# EAGLE design motorShield (EAGLE 7.4.0)
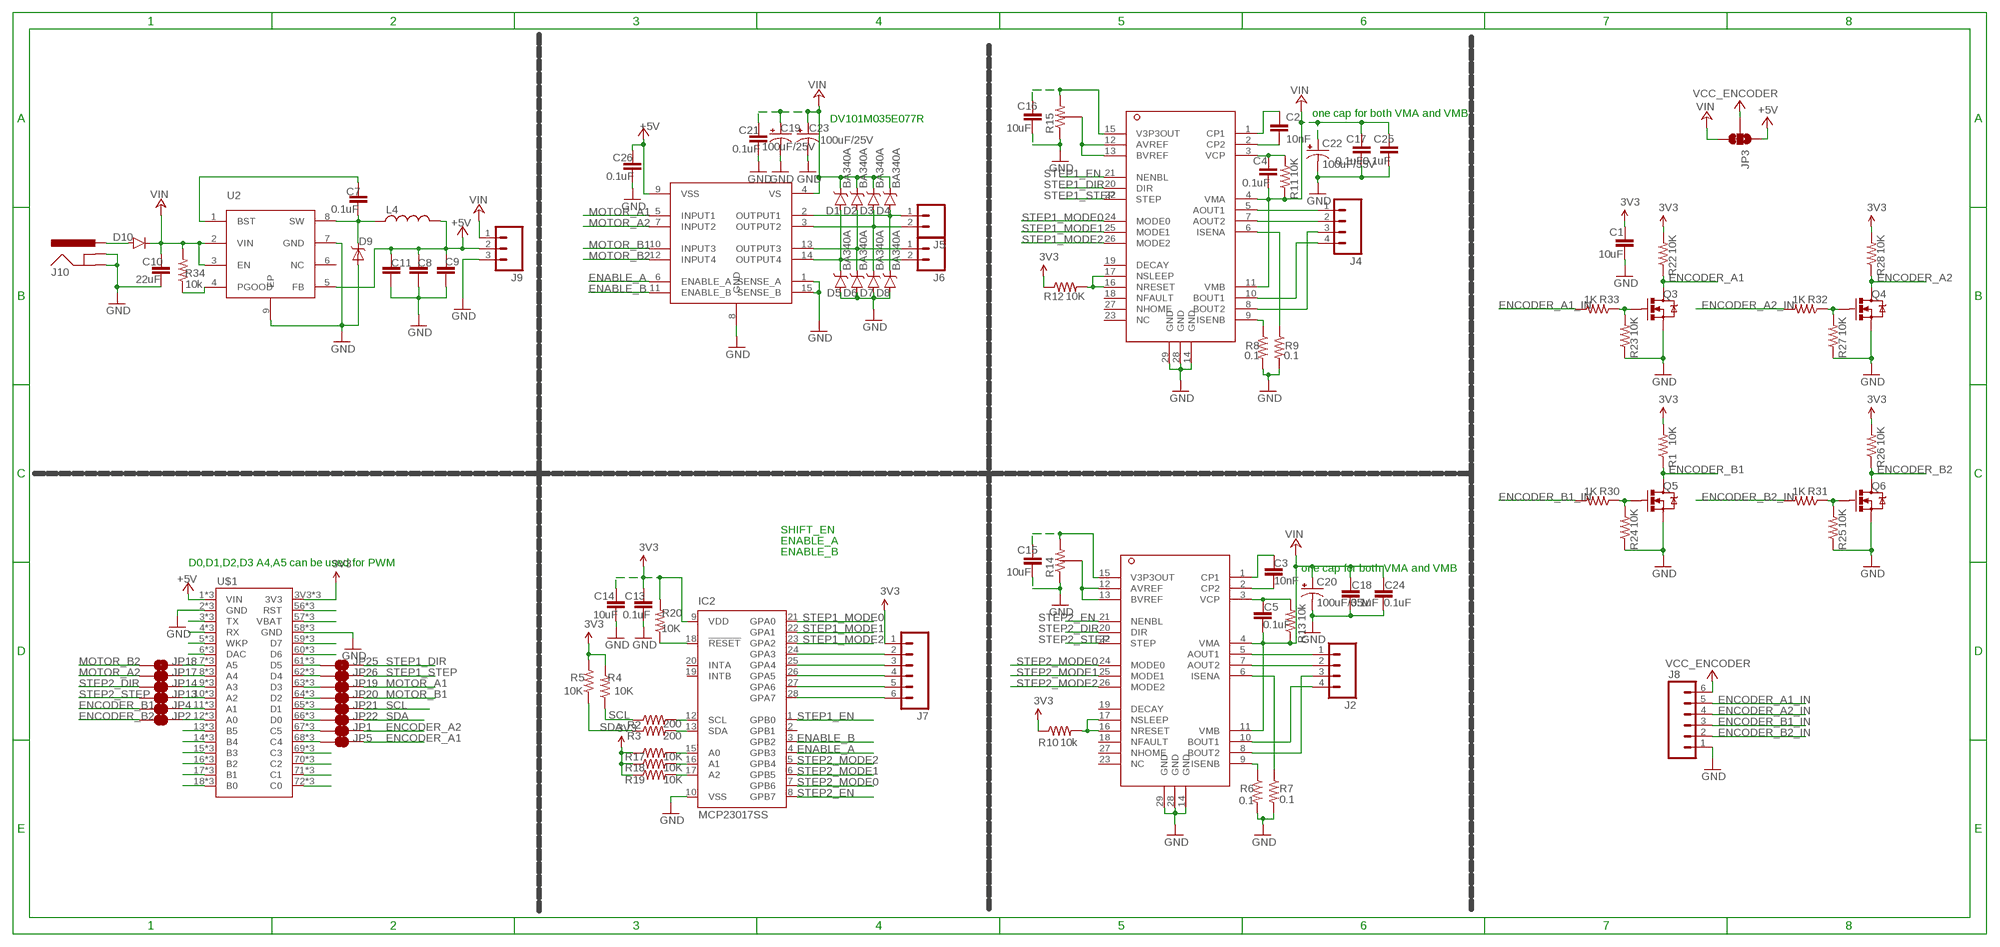
[diagram p0: schematic, sheet 1]

## Parts
C1  10uF  CAP_NONE_POL  [0603]
C2  10nF  CAP_NONE_POL  [0603]
C3  10nF  CAP_NONE_POL  [0603]
C4  0.1uF  CAP_NONE_POL  [0603]
C5  0.1uF  CAP_NONE_POL  [0603]
C7  0.1uF  0.1UF-100V-10%(0603)  [0603-CAP]
C8  10UF10V10%(0805)  [0805-CAP]
C9  10UF10V10%(0805)  [0805-CAP]
C10  22uF  22UF-16V-20%-(1210)  [1210]
C11  10UF10V10%(0805)  [0805-CAP]
C13  0.1uF  CAP_NONE_POL  [0603]
C14  10uF  CAP_NONE_POL  [0603]
C15  10uF  CAP_NONE_POL  [0603]
C16  10uF  CAP_NONE_POL  [0603]
C17  0.1uF  CAP_NONE_POL  [0603]
C18  0.1uF  CAP_NONE_POL  [0603]
C19  100uF/25V  CAP_POLD  [PANASONIC_D]
C20  100uF/35V  CAP_POLD  [PANASONIC_D]
C21  0.1uF  CAP_NONE_POL  [0603]
C22  100uF/35V  CAP_POLD  [PANASONIC_D]
C23  100uF/25V  CAP_POLD  [PANASONIC_D]
C24  0.1uF  CAP_NONE_POL  [0603]
C25  0.1uF  CAP_NONE_POL  [0603]
C26  0.1uF  CAP_NONE_POL  [0603]
D1  BA340A  B340A  [SMA-DIODE]
D2  BA340A  B340A  [SMA-DIODE]
D3  BA340A  B340A  [SMA-DIODE]
D4  BA340A  B340A  [SMA-DIODE]
D5  BA340A  B340A  [SMA-DIODE]
D6  BA340A  B340A  [SMA-DIODE]
D7  BA340A  B340A  [SMA-DIODE]
D8  BA340A  B340A  [SMA-DIODE]
D9  DIODE_SCHOTTKYA  [DIODE_SMA]
D10  DIODEB  [DIODE-DO-220AA_NT(SMP)]
IC2  MCP23017SS  [SSOP28]
J2  M04SCREW  [SCREWTERMINAL-3.5MM-4]
J4  M04SCREW  [SCREWTERMINAL-3.5MM-4]
J5  M023.5MM_LOCK  [SCREWTERMINAL-3.5MM-2_LOCK]
J6  M023.5MM_LOCK  [SCREWTERMINAL-3.5MM-2_LOCK]
J7  M06POLAR  [MOLEX-1X6]
J8  M06POLAR  [MOLEX-1X6]
J9  M03SCREW  [SCREWTERMINAL-3.5MM-3]
J10  POWER_JACKPTH  [POWER_JACK_PTH]
JP1  JUMPER-PAD-2-NC_BY_TRACENO_SILK  [PAD-JUMPER-2-NC_BY_TRACE_NO_SILK]
JP2  JUMPER-PAD-2-NC_BY_TRACENO_SILK  [PAD-JUMPER-2-NC_BY_TRACE_NO_SILK]
JP3  JUMPER-PAD-3-2OF3_NC_BY_TRACE_LARGE  [PAD-JUMPER-3-2OF3_NC_BY_TRACE_YES_SILK_LARGE]
JP4  JUMPER-PAD-2-NC_BY_TRACENO_SILK  [PAD-JUMPER-2-NC_BY_TRACE_NO_SILK]
JP5  JUMPER-PAD-2-NC_BY_TRACENO_SILK  [PAD-JUMPER-2-NC_BY_TRACE_NO_SILK]
JP13  JUMPER-PAD-2-NC_BY_TRACENO_SILK  [PAD-JUMPER-2-NC_BY_TRACE_NO_SILK]
JP14  JUMPER-PAD-2-NC_BY_TRACENO_SILK  [PAD-JUMPER-2-NC_BY_TRACE_NO_SILK]
JP17  JUMPER-PAD-2-NC_BY_TRACENO_SILK  [PAD-JUMPER-2-NC_BY_TRACE_NO_SILK]
JP18  JUMPER-PAD-2-NC_BY_TRACENO_SILK  [PAD-JUMPER-2-NC_BY_TRACE_NO_SILK]
JP19  JUMPER-PAD-2-NC_BY_TRACENO_SILK  [PAD-JUMPER-2-NC_BY_TRACE_NO_SILK]
JP20  JUMPER-PAD-2-NC_BY_TRACENO_SILK  [PAD-JUMPER-2-NC_BY_TRACE_NO_SILK]
JP21  JUMPER-PAD-2-NC_BY_TRACENO_SILK  [PAD-JUMPER-2-NC_BY_TRACE_NO_SILK]
JP22  JUMPER-PAD-2-NC_BY_TRACENO_SILK  [PAD-JUMPER-2-NC_BY_TRACE_NO_SILK]
JP25  JUMPER-PAD-2-NC_BY_TRACENO_SILK  [PAD-JUMPER-2-NC_BY_TRACE_NO_SILK]
JP26  JUMPER-PAD-2-NC_BY_TRACENO_SILK  [PAD-JUMPER-2-NC_BY_TRACE_NO_SILK]
L4  INDUCTOR4818  [I4818]
Q3  MOSFET-NCHANNELBSS138  [SOT23]
Q4  MOSFET-NCHANNELBSS138  [SOT23]
Q5  MOSFET-NCHANNELBSS138  [SOT23]
Q6  MOSFET-NCHANNELBSS138  [SOT23]
R1  10K  R-US_A  [R0603]
R2  200  R-US_A  [R0603]
R3  200  R-US_A  [R0603]
R4  10K  R-US_A  [R0603]
R5  10K  R-US_A  [R0603]
R6  0.1  R-US_M1206  [M1206]
R7  0.1  R-US_M1206  [M1206]
R8  0.1  R-US_M1206  [M1206]
R9  0.1  R-US_M1206  [M1206]
R10  10k  R-US_A  [R0603]
R11  10K  R-US_A  [R0603]
R12  10K  R-US_A  [R0603]
R13  10k  R-US_A  [R0603]
R14  POTENTIAL_RESISTOR  [POTENTIAL_RESISTOR_2]
R15  POTENTIAL_RESISTOR  [POTENTIAL_RESISTOR_2]
R17  10K  R-US_A  [R0603]
R18  10K  R-US_A  [R0603]
R19  10K  R-US_A  [R0603]
R20  10K  R-US_A  [R0603]
R22  10K  R-US_A  [R0603]
R23  10K  R-US_A  [R0603]
R24  10K  R-US_A  [R0603]
R25  10K  R-US_A  [R0603]
R26  10K  R-US_A  [R0603]
R27  10K  R-US_A  [R0603]
R28  10K  R-US_A  [R0603]
R30  1K  R-US_A  [R0603]
R31  1K  R-US_A  [R0603]
R32  1K  R-US_A  [R0603]
R33  1K  R-US_A  [R0603]
R34  10k  20OHM1/10W1%(0603)SMD  [0603-RES]
U2  ADP2303  [ADP2302]
U$1  ELECTRONDUALROW  [ELECTRON_DUAL-ROW]
U?1  DRV8825  [DRV8825]
U?2  L298  [L298]
U?3  DRV8825  [DRV8825]

## Nets
+5V: C8.2 C9.2 C11.1 C26.1(ANODE) J8.6 J9.2 JP3.1 JP3.2 L4.2 U2.5(FB) U$1.1(VIN) U$1.37(VIN) U$1.VIN U?2.9(VSS) ; supply symbol labelled VCC_ENCODER
+24V: C4.2(CATHODE) C5.2(CATHODE) C10.1 C17.1(ANODE) C18.1(ANODE) C19.+ C20.+ C21.1(ANODE) C22.+ C23.+ C24.1(ANODE) C25.1(ANODE) D1.C D2.C D3.C D4.C D10.CATHODE J9.1 JP3.3 R11.1 R13.1 R34.2 U2.2(VIN) U2.3(EN) U?1.4(VMA) U?1.11(VMB) U?2.4(VS) U?3.4(VMA) U?3.11(VMB) ; supply symbol labelled VIN
ENABLE_A: IC2.4(GPB3) U?2.6(ENABLE_A)
ENABLE_B: IC2.3(GPB2) U?2.11(ENABLE_B)
ENCODER_A1: JP5.2 Q3.3(D) R22.1
ENCODER_A1_IN: J8.5 R33.2
ENCODER_A2: JP1.2 Q4.3(D) R28.1
ENCODER_A2_IN: J8.4 R32.2
ENCODER_B1: JP4.1 Q5.3(D) R1.1
ENCODER_B1_IN: J8.3 R30.2
ENCODER_B2: JP2.1 Q6.3(D) R26.1
ENCODER_B2_IN: J8.2 R31.2
GND: C1.2(CATHODE) C8.1 C9.1 C10.2 C11.2 C13.2(CATHODE) C14.2(CATHODE) C15.2(CATHODE) C16.2(CATHODE) C17.2(CATHODE) C18.2(CATHODE) C19.- C20.- C21.2(CATHODE) C22.- C23.- C24.2(CATHODE) C25.2(CATHODE) C26.2(CATHODE) D5.A D6.A D7.A D8.A D9.ANODE IC2.10(VSS) J8.1 J9.3 J10.GND J10.GNDBREAK Q3.2(S) Q4.2(S) Q5.2(S) Q6.2(S) R6.2 R7.2 R8.2 R9.2 R14.1 R15.1 R23.1 R24.1 R25.1 R27.1 U2.7(GND) U2.9(EP) U$1.2(GND) U$1.38(GND) U$1.58(GND) U$1.94(GND) U$1.GND U$1.GND@2(GND) U?1.14(GND) U?1.28(GND) U?1.29(GND) U?2.1(SENSE_A) U?2.8(GND) U?2.15(SENSE_B) U?3.14(GND) U?3.28(GND) U?3.29(GND)
MOTOR_A1: JP19.2 U?2.5(INPUT1)
MOTOR_A2: JP17.1 U?2.7(INPUT2)
MOTOR_B1: JP20.2 U?2.10(INPUT3)
MOTOR_B2: JP18.1 U?2.12(INPUT4)
N$1: IC2.13(SDA) R3.2
N$2: IC2.12(SCL) R2.2
N$3: C3.2(CATHODE) U?3.2(CP2)
N$4: C3.1(ANODE) U?3.1(CP1)
N$5: C2.2(CATHODE) U?1.2(CP2)
N$6: C2.1(ANODE) U?1.1(CP1)
N$7: R6.1 U?3.9(ISENB)
N$8: R7.1 U?3.6(ISENA)
N$9: R10.2 U?3.16(NRESET) U?3.17(NSLEEP)
N$10: D4.A D8.C J5.1 U?2.2(OUTPUT1)
N$11: J2.1 U?3.5(AOUT1)
N$12: J2.2 U?3.7(AOUT2)
N$13: J2.4 U?3.10(BOUT1)
N$14: J2.3 U?3.8(BOUT2)
N$15: R8.1 U?1.9(ISENB)
N$16: R9.1 U?1.6(ISENA)
N$17: J4.1 U?1.5(AOUT1)
N$18: J4.2 U?1.7(AOUT2)
N$19: J4.4 U?1.10(BOUT1)
N$20: J4.3 U?1.8(BOUT2)
N$21: C4.1(ANODE) R11.2 U?1.3(VCP)
N$22: C5.1(ANODE) R13.2 U?3.3(VCP)
N$23: D3.A D7.C J5.2 U?2.3(OUTPUT2)
N$24: D2.A D6.C J6.1 U?2.13(OUTPUT3)
N$25: D1.A D5.C J6.2 U?2.14(OUTPUT4)
N$26: JP26.1 U$1.62(D4) U$1.98(D4) U$1.D4
N$27: IC2.15(A0) R17.2
N$28: R12.2 U?1.16(NRESET) U?1.17(NSLEEP)
N$29: IC2.16(A1) R18.2
N$30: IC2.17(A2) R19.2
N$31: R15.3 U?1.12(AVREF) U?1.13(BVREF)
N$32: IC2.18(!RESET) R20.1
N$33: IC2.28(GPA7) J7.6
N$34: R14.3 U?3.12(AVREF) U?3.13(BVREF)
N$35: IC2.27(GPA6) J7.5
N$36: IC2.26(GPA5) J7.4
N$37: IC2.25(GPA4) J7.3
N$38: IC2.24(GPA3) J7.2
N$39: JP25.1 U$1.61(D5) U$1.97(D5) U$1.D5
N$40: JP1.1 U$1.67(C5) U$1.103(C5) U$1.C5
N$41: JP2.2 U$1.12(A0) U$1.48(A0) U$1.A0
N$42: JP4.2 U$1.11(A1) U$1.47(A1) U$1.A1
N$44: JP5.1 U$1.68(C4) U$1.104(C4) U$1.C4
N$46: U$1.72(C0) U$1.108(C0) U$1.C0
N$47: U$1.71(C1) U$1.107(C1) U$1.C1
N$48: U$1.70(C2) U$1.106(C2) U$1.C2
N$49: U$1.69(C3) U$1.105(C3) U$1.C3
N$50: U$1.60(D6) U$1.96(D6) U$1.D6
N$51: Q4.1(G) R27.2 R32.1
N$52: Q5.1(G) R24.2 R30.1
N$53: Q6.1(G) R25.2 R31.1
N$54: C7.2 D9.CATHODE L4.1 U2.8(SW)
N$55: Q3.1(G) R23.2 R33.1
N$56: C7.1 U2.1(BST)
N$57: R34.1 U2.4(PGOOD)
N$58: D10.ANODE J10.PWR
N$59: U$1.59(D7) U$1.95(D7) U$1.D7
N$61: JP13.2 U$1.10(A2) U$1.46(A2) U$1.A2
N$62: JP14.2 U$1.9(A3) U$1.45(A3) U$1.A3
N$63: JP17.2 U$1.8(A4) U$1.44(A4) U$1.A4
N$64: JP18.2 U$1.7(A5) U$1.43(A5) U$1.A5
N$65: JP19.1 U$1.63(D3) U$1.99(D3) U$1.D3
N$66: JP20.1 U$1.64(D2) U$1.100(D2) U$1.D2
N$67: JP21.1 U$1.65(D1) U$1.101(D1) U$1.D1
N$68: JP22.1 U$1.66(D0) U$1.102(D0) U$1.D0
N$69: U$1.57(VBAT) U$1.93(VBAT) U$1.VBAT
N$70: U$1.56(RST) U$1.92(RST) U$1.RST
N$71: U$1.3(TX) U$1.39(TX) U$1.TX
N$72: U$1.4(RX) U$1.40(RX) U$1.RX
N$73: C15.1(ANODE) R14.2 U?3.15(V3P3OUT)
N$74: U$1.5(WKP) U$1.41(WKP) U$1.WKP
N$75: U$1.6(DAC) U$1.42(DAC) U$1.DAC
N$76: U$1.13(B5) U$1.49(B5) U$1.B5
N$77: U$1.14(B4) U$1.50(B4) U$1.B4
N$78: C16.1(ANODE) R15.2 U?1.15(V3P3OUT)
N$79: U$1.15(B3) U$1.51(B3) U$1.B3
N$80: U$1.16(B2) U$1.52(B2) U$1.B2
N$81: U$1.17(B1) U$1.53(B1) U$1.B1
N$82: U$1.18(B0) U$1.54(B0) U$1.B0
SCL: JP21.2 R2.1 R4.1
SDA: JP22.2 R3.1 R5.1
STEP1_DIR: JP25.2 U?1.20(DIR)
STEP1_EN: IC2.1(GPB0) U?1.21(NENBL)
STEP1_MODE0: IC2.21(GPA0) U?1.24(MODE0)
STEP1_MODE1: IC2.22(GPA1) U?1.25(MODE1)
STEP1_MODE2: IC2.23(GPA2) U?1.26(MODE2)
STEP1_STEP: JP26.2 U?1.22(STEP)
STEP2_DIR: JP14.1 U?3.20(DIR)
STEP2_EN: IC2.8(GPB7) U?3.21(NENBL)
STEP2_MODE0: IC2.7(GPB6) U?3.24(MODE0)
STEP2_MODE1: IC2.6(GPB5) U?3.25(MODE1)
STEP2_MODE2: IC2.5(GPB4) U?3.26(MODE2)
STEP2_STEP: JP13.1 U?3.22(STEP)
VDD: C1.1(ANODE) C13.1(ANODE) C14.1(ANODE) IC2.9(VDD) J7.1 R1.2 R4.2 R5.2 R10.1 R12.1 R17.1 R18.1 R19.1 R20.2 R22.2 R26.2 R28.2 U$1.3V3 U$1.55(3V3) U$1.91(3V3) ; supply symbol labelled 3V3
Unconnected: IC2.2(GPB1) IC2.19(INTB) IC2.20(INTA) U2.6(NC) U?1.18(NFAULT) U?1.19(DECAY) U?1.23(NC) U?1.27(NHOME) U?3.18(NFAULT) U?3.19(DECAY) U?3.23(NC) U?3.27(NHOME)

## Notes on the sheet
- one cap for both VMA and VMB
- DV101M035E077R
- SHIFT_EN
- ENABLE_A
- ENABLE_B
- D0,D1,D2,D3 A4,A5 can be used for PWM
- one cap for both VMA and VMB

## Library data of the parts
C1-C5 C13-C18 C21 C24-C26 = Particle:CAP_NONE_POL
C7 = SparkFun-Capacitors:0.1UF-100V-10%(0603): CAP-08390; PROD_ID: CAP-08390
C8 C9 C11 = programming-rig-v402:10UF10V10%(0805): CAP-11330; PROD_ID: CAP-11330
C10 = programming-rig-v402:22UF-16V-20%-(1210): CAP-10381; PROD_ID: CAP-10381
C19 C20 C22 C23 = SparkFun-Capacitors:CAP_POL: Capacitor Polarized These are standard SMD and PTH capacitors. Normally 10uF, 47uF, and 100uF in electrolytic and tantalum varieties. Always verify the external diameter of the through hole cap, it varies with capacity, voltage, and manufacturer. The EIA devices should be standard.
D1-D8 = SparkFun-DiscreteSemi:B340A: Schottky Diode 3A-40V; PROD_ID: DIO-09886
D9 = Particle:DIODE_SCHOTTKY
D10 = Particle:DIODE
IC2 = programming-rig-v402:MCP23017: http://ww1.microchip.com/downloads/en/DeviceDoc/21952a.pdf Source: http://ww1.microchip.com/downloads/en/DeviceDoc/21952a.pdf
J2 J4 = SparkFun-Connectors:M04: Header 4 Standard 4-pin 0.1" header. Use with straight break away headers (SKU : PRT-00116), right angle break away headers (PRT-00553), swiss pins (PRT-00743), machine pins (PRT-00117), and female headers (PRT-00115). Molex polarized connector foot print use with SKU : PRT-08231 with associated crimp pins and housings. 1MM SMD Version SKU: PRT-10208; PROD_ID: Combine 2x8399
J5 J6 = SparkFun-Connectors:M02: Standard 2-pin 0.1" header. Use with - straight break away headers ( PRT-00116) - right angle break away headers (PRT-00553) - swiss pins (PRT-00743) - machine pins (PRT-00117) - female headers (PRT-00115) Molex polarized connector foot print use with: PRT-08233 with associated crimp pins and housings. 2.54_SCREWTERM for use with PRT-10571. 3.5mm Screw Terminal footprints for PRT-08084 5mm Screw Terminal footprints for use with PRT-08432; PROD_ID: CONN-08399
J7 J8 = SparkFun-Connectors:M06: Header 6 Standard 6-pin 0.1" header. Use with straight break away headers (SKU : PRT-00116), right angle break away headers (PRT-00553), swiss pins (PRT-00743), machine pins (PRT-00117), and female headers (PRT-00115). Molex polarized connector foot print use with SKU : PRT-08094 with associated crimp pins and housings. NOTES ON THE VARIANTS LOCK and LOCK_LONGPADS... This footprint was designed to help hold the alignment of a through-hole component (i.e. 6-pin header) while soldering it into place. You may notice that each hole has been shifted either up or down by 0.005 of an inch from it's more standard position (which is a perfectly straight line). This slight alteration caused the pins (the squares in the middle) to touch the edges of the holes. Because they are alternating, it causes a "brace" to hold the component in place. 0.005 has proven to be the perfect amount of "off-center" position when using our standard breakaway headers. Although looks a little odd when you look at the bare footprint, once you have a header in there, the alteration is very hard to notice. Also,if you push a header all the way into place, it is covered up entirely on the bottom side. This idea of altering the position of holes to aid alignment will be further integrated into the Sparkfun Library for other footprints. It can help hold any component with 3 or more connection pins.
J9 = SparkFun-Connectors:M03: Header 3 Standard 3-pin 0.1" header. Use with straight break away headers (SKU : PRT-00116), right angle break away headers (PRT-00553), swiss pins (PRT-00743), machine pins (PRT-00117), and female headers (PRT-00115). Molex polarized connector foot print use with SKU : PRT-08232 with associated crimp pins and housings.; PROD_ID: CONN-08288
J10 = SparkFun-Connectors:POWER_JACK: Power Jack This is the standard 5.5mm barrel jack for power. The PTH is the most common, proven, reliable, footprint. The Slot footprint only works if the mill layer is transmitted to the PCB fab house so be warned. Mating wall wart : TOL-00298 (and others); PROD_ID: CONN-08197
JP1 JP2 JP4 JP5 JP13 JP14 JP17-JP22 JP25 JP26 = SparkFun-Passives:JUMPER-PAD-2-NC_BY_TRACE
JP3 = SparkFun-Passives:JUMPER-PAD-3-2OF3_NC_BY_TRACE
L4 = programming-rig-v402:INDUCTOR: Inductors Basic Inductor/Choke - 0603 and 1206. Footprints are not proven and vary greatly between part numbers.
Q3-Q6 = shield-shield:MOSFET-NCHANNEL: Common NMOSFET Parts MFG P/N Store ID Prod ID FDD8780 TRANS-09984 SI7820DN TRANS-11055 FDS6630A IC-08089 2N7002PW TRANS-11151 FQP30N06L COM-10213 TRANS-10060 BSS123LT1G TRANS-08345 BSS138 TRANS-00830 BS170 2N7000; PROD_ID: TRANS-00830
R1-R5 R10-R13 R17-R20 R22-R28 R30-R33 = Particle:R-US_: 0402 Resistor
R6-R9 = programming-rig-v402:R-US_: RESISTOR, American symbol
R14 R15 = SparkFun-Resistors:POTENTIAL_RESISTOR
R34 = SparkFun-Resistors:20OHM1/10W1%(0603): RES-07862; PROD_ID: RES-07862; VALUE: 20
U2 = Particle:ADP2303
U$1 = Particle:ELECTRON
U?1 U?3 = Particle:DRV8825
U?2 = Particle:L298

## Board
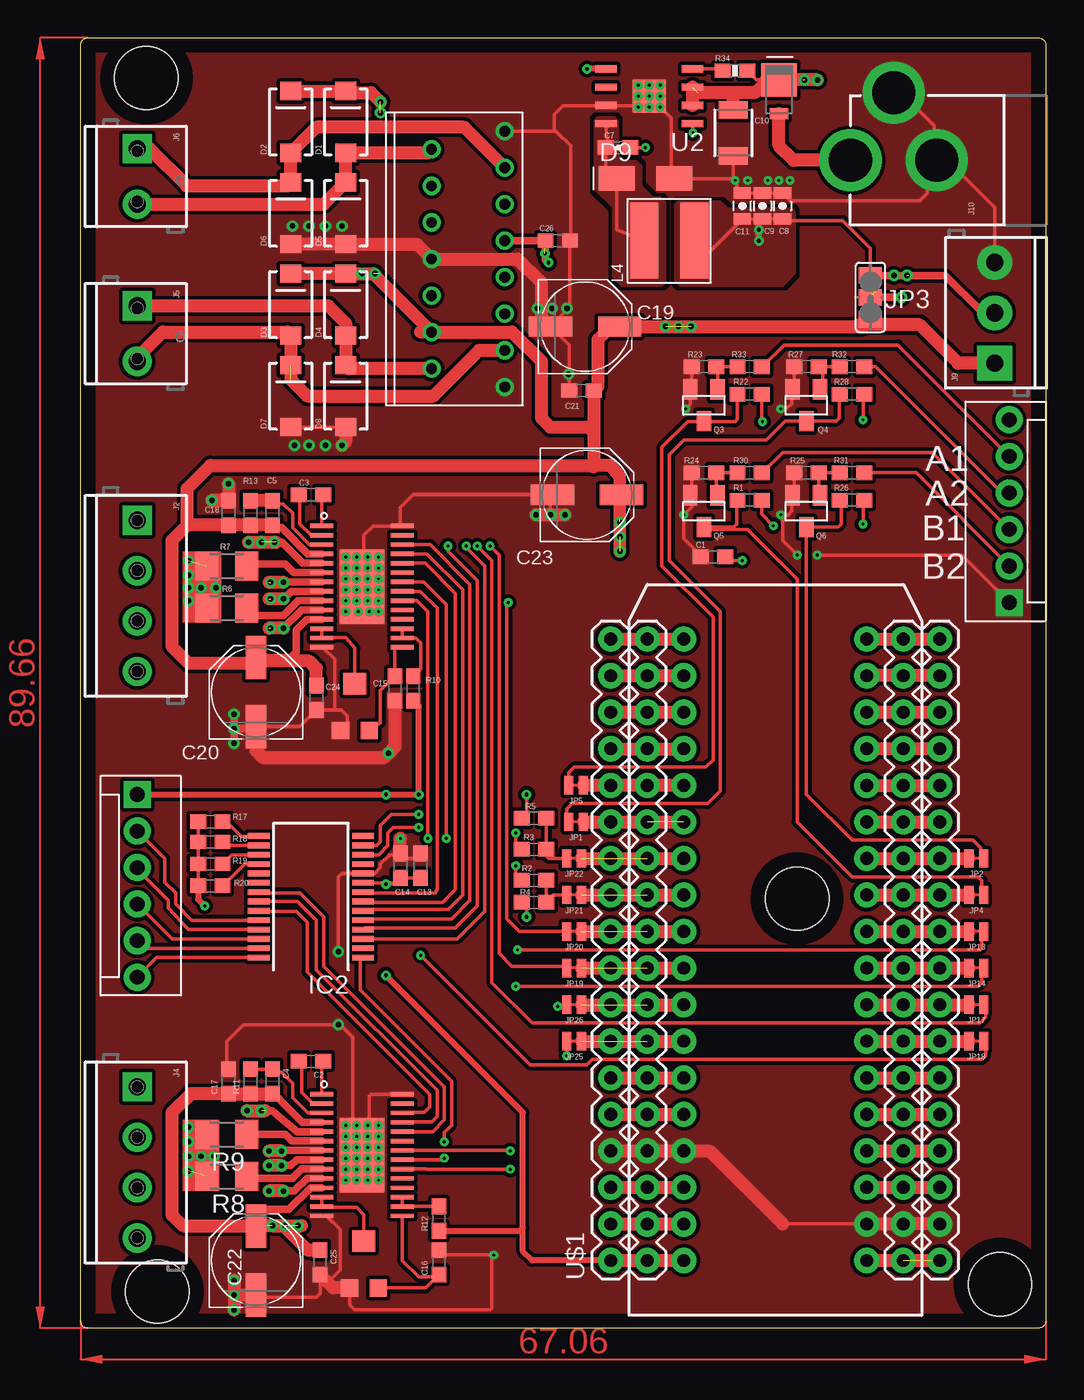
[diagram p1: board, top side]
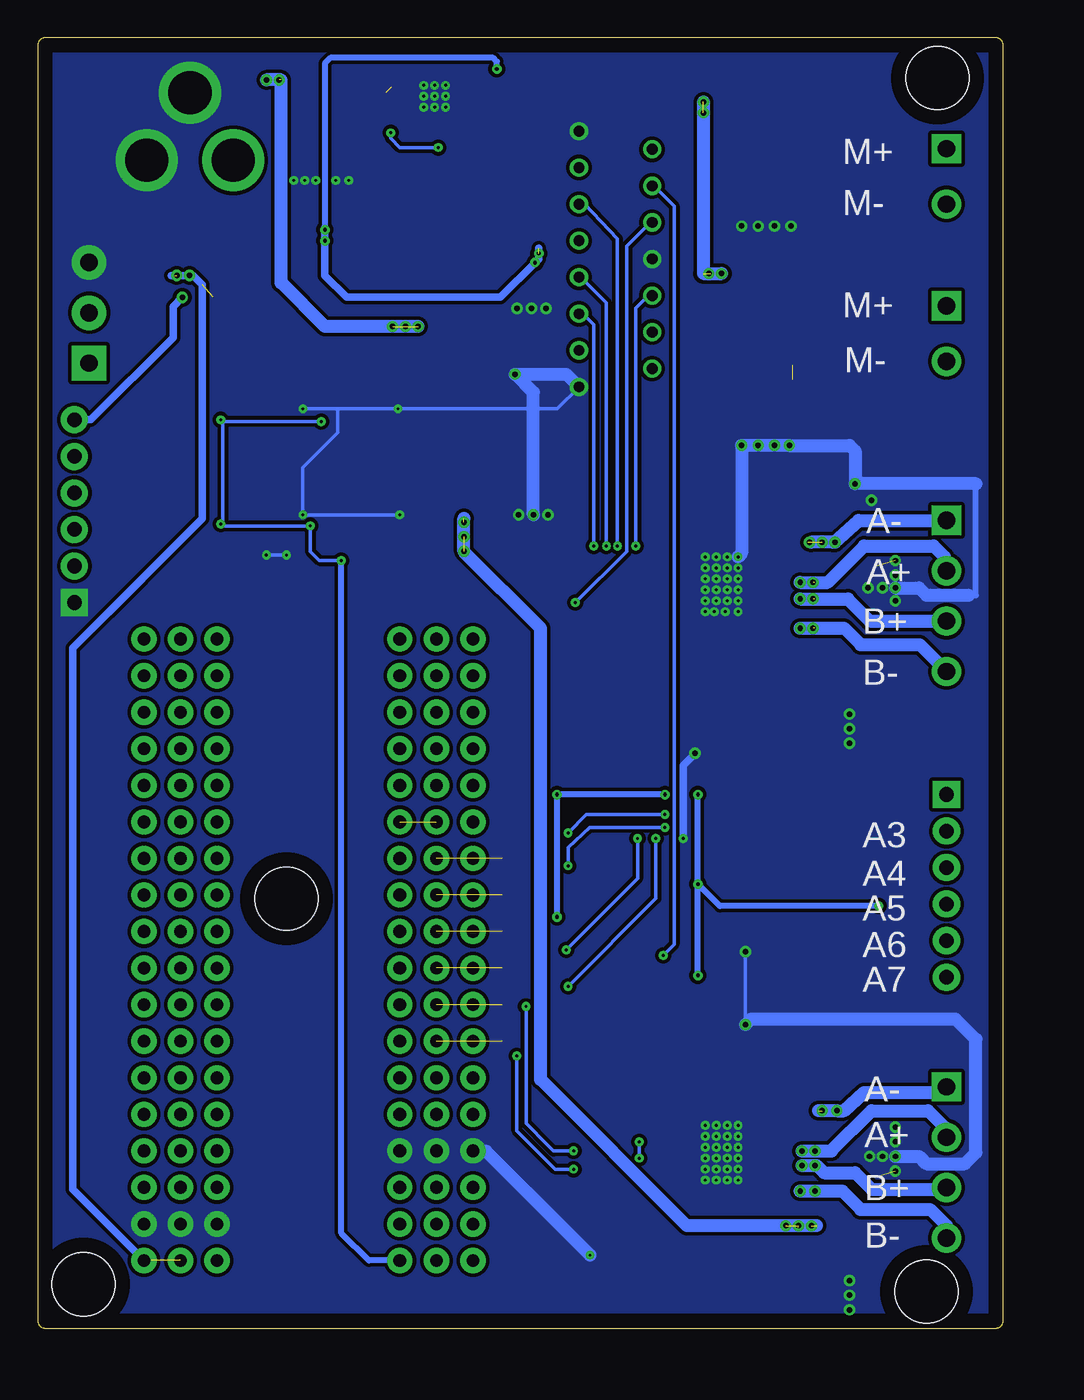
[diagram p2: board, bottom side, seen from below]

Size 67.06 x 89.66 mm. Coordinates in mm from the lower left corner, seen from the top.
Outline: 0.51,89.66 66.55,89.66 arc-90 67.06,89.15 67.06,0.51 arc-90 66.55,0 0.51,0 arc-90 0,0.51 0,89.15 arc-90 0.51,89.66
Copper layers (1*16): Top 0.035mm / dielectric 1.5mm / Bottom 0.035mm
Design rules "default *": minimum track width 10mil, minimum drill 24mil, track to track 8mil, track to pad 8mil, pad to pad 8mil, via to via 8mil, smd to smd 8mil, copper to edge 40mil, drill to drill 8mil, minimum pad ring 10mil, minimum via ring 8mil, stop-mask expansion 4mil, vias tented up to drill 15mil, thermal gap 10mil
Holes 4.39 mm at 5.33,2.54 63.88,3.05 4.57,86.87 49.78,29.84

### Footprints (pad centres in the part's own frame; a part is rotated, then mirrored left to right if it is on the bottom)
0603 = smd 1.1 x 1: 1 -0.85,0; 2 0.85,0
0603-CAP = smd 1.1 x 1: 1 -0.85,0; 2 0.85,0
0805-CAP = smd 0.8 x 1.2: 1 -0.9,0; 2 0.9,0
1210 = smd 1.2 x 2: 1 -1.6,0; 2 1.6,0
PANASONIC_D = smd 3 x 1.4: + 2.4,0; - -2.4,0
SMA-DIODE = smd 1.27 x 1.47: A -2.15,0; C 2.15,0
DIODE_SMA = smd 2.5 x 1.7: ANODE 2,0; CATHODE -2,0
DIODE-DO-220AA_NT(SMP) = smd 0.762 x 1.27: ANODE 2.349,0 | smd 2.337 x 2.464: CATHODE 0,0
SSOP28 = smd 0.4 x 1.5: 1 -4.225,-3.625; 2 -3.575,-3.625; 3 -2.925,-3.625; 4 -2.275,-3.625; 5 -1.625,-3.625; 6 -0.975,-3.625; 7 -0.325,-3.625; 8 0.325,-3.625; 9 0.975,-3.625; 10 1.625,-3.625; 11 2.275,-3.625; 12 2.925,-3.625; 13 3.575,-3.625; 14 4.225,-3.625; 15 4.225,3.625; 16 3.575,3.625; 17 2.925,3.625; 18 2.275,3.625; 19 1.625,3.625; 20 0.975,3.625; 21 0.325,3.625; 22 -0.325,3.625; 23 -0.975,3.625; 24 -1.625,3.625; 25 -2.275,3.625; 26 -2.925,3.625; 27 -3.575,3.625; 28 -4.225,3.625
SCREWTERMINAL-3.5MM-4 = drill 1.2 pad 2.032 square: 1 0,0 | drill 1.2 pad 2.032: 2 3.5,0; 3 7,0; 4 10.5,0
SCREWTERMINAL-3.5MM-2_LOCK = drill 1.2 pad 2.032 square: 1 -0.178,0 | drill 1.2 pad 2.032: 2 3.678,0
MOLEX-1X6 = drill 1.016 pad 1.88 square: 1 0,0 | drill 1.016 pad 1.88: 2 2.54,0; 3 5.08,0; 4 7.62,0; 5 10.16,0; 6 12.7,0
SCREWTERMINAL-3.5MM-3 = drill 1.2 pad 2.413 square: 1 0,0 | drill 1.2 pad 2.413: 2 3.5,0; 3 7,0
POWER_JACK_PTH = drill 2.997 pad 4.318: GND 0,7.7; GNDBREAK 4.7,10.7; PWR 0,13.7
PAD-JUMPER-2-NC_BY_TRACE_NO_SILK = smd 0.635 x 1.27: 1 -0.508,0; 2 0.508,0
PAD-JUMPER-3-2OF3_NC_BY_TRACE_YES_SILK_LARGE = smd 1.168 x 1.6: 1 -1.524,0; 2 0,0; 3 1.524,0
I4818 = smd 5.3 x 2: 1 0,1.75; 2 0,-1.75
SOT23 = smd 1 x 1.4: 1 -0.95,-1.1; 2 0.95,-1.1; 3 0,1.1
R0603 = smd 1.1 x 1: 1 -0.85,0; 2 0.85,0
M1206 = smd 1.6 x 2: 1 -1.4,0; 2 1.4,0
POTENTIAL_RESISTOR_2 = smd 1.2 x 1.2: 1 -1,0; 2 1,0 | smd 1.6 x 1.5: 3 0,3.25
0603-RES = smd 1.1 x 1: 1 -0.85,0; 2 0.85,0
ADP2302 = smd 1.5 x 0.5: 1 -3,1.905; 2 -3,0.635; 3 -3,-0.635; 4 -3,-1.905; 5 3,-1.905; 6 3,-0.635; 7 3,0.636; 8 3,1.905 | smd 2.29 x 2.29: 9 0,0
ELECTRON_DUAL-ROW = drill 0.889 pad 1.753: 1 1.27,2.54; 2 3.81,2.54; 3 6.35,2.54; 3V3 1.27,22.86; 4 8.89,2.54; 5 11.43,2.54; 6 13.97,2.54; 7 16.51,2.54; 8 19.05,2.54; 9 21.59,2.54; 10 24.13,2.54; 11 26.67,2.54; 12 29.21,2.54; 13 31.75,2.54; 14 34.29,2.54; 15 36.83,2.54; 16 39.37,2.54; 17 41.91,2.54; 18 44.45,2.54; 37 1.27,7.62; 38 3.81,7.62; 39 6.35,7.62; 40 8.89,7.62; 41 11.43,7.62; 42 13.97,7.62; 43 16.51,7.62; 44 19.05,7.62; 45 21.59,7.62; 46 24.13,7.62; 47 26.67,7.62; 48 29.21,7.62; 49 31.75,7.62; 50 34.29,7.62; 51 36.83,7.62; 52 39.37,7.62; 53 41.91,7.62; 54 44.45,7.62; 55 1.27,20.32; 56 3.81,20.32; 57 6.35,20.32; 58 8.89,20.32; 59 11.43,20.32; 60 13.97,20.32; 61 16.51,20.32; 62 19.05,20.32; 63 21.59,20.32; 64 24.13,20.32; 65 26.67,20.32; 66 29.21,20.32; 67 31.75,20.32; 68 34.29,20.32; 69 36.83,20.32; 70 39.37,20.32; 71 41.91,20.32; 72 44.45,20.32; 91 1.27,25.4; 92 3.81,25.4; 93 6.35,25.4; 94 8.89,25.4; 95 11.43,25.4; 96 13.97,25.4; 97 16.51,25.4; 98 19.05,25.4; 99 21.59,25.4; 100 24.13,25.4; 101 26.67,25.4; 102 29.21,25.4; 103 31.75,25.4; 104 34.29,25.4; 105 36.83,25.4; 106 39.37,25.4; 107 41.91,25.4; 108 44.45,25.4; A0 29.21,5.08; A1 26.67,5.08; A2 24.13,5.08; A3 21.59,5.08; A4 19.05,5.08; A5 16.51,5.08; B0 44.45,5.08; B1 41.91,5.08; B2 39.37,5.08; B3 36.83,5.08; B4 34.29,5.08; B5 31.75,5.08; C0 44.45,22.86; C1 41.91,22.86; C2 39.37,22.86; C3 36.83,22.86; C4 34.29,22.86; C5 31.75,22.86; D0 29.21,22.86; D1 26.67,22.86; D2 24.13,22.86; D3 21.59,22.86; D4 19.05,22.86; D5 16.51,22.86; D6 13.97,22.86; D7 11.43,22.86; DAC 13.97,5.08; GND 8.89,22.86; GND@2 3.81,5.08; RST 3.81,22.86; RX 8.89,5.08; TX 6.35,5.08; VBAT 6.35,22.86; VIN 1.27,5.08; WKP 11.43,5.08
DRV8825 = smd 0.3 x 1.6: 1 0,0; 2 0.65,0; 3 1.3,0; 4 1.95,0; 5 2.6,0; 6 3.25,0; 7 3.9,0; 8 4.55,0; 9 5.2,0; 10 5.85,0; 11 6.5,0; 12 7.15,0; 13 7.8,0; 14 8.45,0; 15 8.45,5.6; 16 7.8,5.6; 17 7.15,5.6; 18 6.5,5.6; 19 5.85,5.6; 20 5.2,5.6; 21 4.55,5.6; 22 3.9,5.6; 23 3.25,5.6; 24 2.6,5.6; 25 1.95,5.6; 26 1.3,5.6; 27 0.65,5.6; 28 0,5.6 | smd 5.18 x 3.1: 29 4.225,2.8
L298 = drill 0.75 pad 1.2: 1 0,0; 2 1.27,5.08; 3 2.54,0; 4 3.81,5.08; 5 5.08,0; 6 6.35,5.08; 7 7.62,0; 8 8.89,5.08; 9 10.16,0; 10 11.43,5.08; 11 12.7,0; 12 13.97,5.08; 13 15.24,0; 14 16.51,5.08; 15 17.78,0

### Placement (x,y rotation side)
C1  43.94,53.59 180 top
C2  16,18.54 180 top
C3  16,57.91 180 top
C4  13.34,17.14 270 top
C5  13.34,56.64 270 top
C7  37.34,82.04 180 top
C8  48.77,77.98 270 top
C9  47.37,77.98 270 top
C10  45.34,83.06 270 top
C11  45.97,77.98 90 top
C13  23.62,32.13 90 top
C14  22.23,32.13 90 top
C15  21.84,44.45 270 top
C16  24.89,4.57 90 top
C17  10.29,17.14 90 top
C18  10.29,56.64 90 top
C19  35.05,69.6 0 top
C20  12.19,44.2 90 top
C21  34.8,65.15 180 top
C22  12.19,4.7 90 top
C23  35.18,57.91 0 top
C24  16.38,43.81 270 top
C25  16.64,4.57 270 top
C26  33.15,75.56 0 top
D1  18.41,83.82 90 top
D2  14.61,83.82 90 top
D3  14.61,71.12 90 top
D4  18.41,71.12 90 top
D5  18.41,77.47 90 top
D6  14.61,77.47 90 top
D7  14.61,64.77 90 top
D8  18.41,64.77 90 top
D9  39.24,79.88 0 top
D10  48.51,86.74 270 top
IC2  16,29.97 90 top
J2  3.94,56.13 270 top
J4  3.94,16.76 270 top
J5  3.94,70.87 270 top
J6  3.94,81.79 270 top
J7  3.94,37.08 270 top
J8  64.52,50.42 90 top
J9  63.5,67.06 90 top
J10  67.18,81.15 90 top
JP1  34.42,35.18 180 top
JP2  62.23,32.64 180 top
JP3  54.86,71.63 270 top
JP4  62.23,30.1 180 top
JP5  34.42,37.72 180 top
JP13  62.23,27.56 180 top
JP14  62.23,25.02 180 top
JP17  62.23,22.48 180 top
JP18  62.23,19.94 180 top
JP19  34.29,25.02 180 top
JP20  34.29,27.56 180 top
JP21  34.29,30.1 180 top
JP22  34.29,32.64 180 top
JP25  34.29,19.94 180 top
JP26  34.29,22.48 180 top
L4  40.89,75.56 90 top
Q3  43.31,64.14 180 top
Q4  50.42,64.14 180 top
Q5  43.31,56.77 180 top
Q6  50.42,56.77 180 top
R1  46.48,57.53 0 top
R2  31.5,31.11 180 top
R3  31.5,33.27 180 top
R4  31.5,29.59 180 top
R5  31.5,35.43 180 top
R6  10.16,50.04 180 top
R7  10.16,52.96 180 top
R8  10.16,10.54 180 top
R9  10.16,13.46 180 top
R10  23.11,44.45 90 top
R11  11.81,17.14 90 top
R12  24.89,7.62 90 top
R13  11.81,56.64 90 top
R14  19.05,41.53 0 top
R15  19.69,2.79 0 top
R17  9.02,35.18 0 top
R18  9.02,33.78 0 top
R19  9.02,32.26 0 top
R20  9.02,30.73 180 top
R22  46.48,64.9 0 top
R23  43.31,66.8 0 top
R24  43.31,59.44 0 top
R25  50.42,59.44 0 top
R26  53.59,57.53 0 top
R27  50.42,66.8 0 top
R28  53.59,64.9 0 top
R30  46.48,59.44 0 top
R31  53.59,59.44 0 top
R32  53.59,66.8 0 top
R33  46.48,66.8 0 top
R34  45.47,87.38 0 top
U2  39.5,85.6 180 top
U$1  62.23,3.43 90 top
U?1  16.76,16.26 270 top
U?2  29.46,65.41 90 top
U?3  16.76,55.75 270 top

### Tracks (layer width: path | path; a pad name or v marks a point on that pad's centre or on a via)
+5V  (via drill 0.25, 0.38 pad 0.51)  (4 unrouted)
  Top 0.254: 54.92,71.57 JP3.2 | L4.2 43.32,74.42 C11.1 C9.2 47.49,77.08 47.5,77.09 C8.2 48.88,76.96 52.96,76.96 54.86,75.06 JP3.1
  Top 0.406: 36.58,87.5 U2.5 v35.18,87.5 | v47.12,75.56 47.12,76.82 C9.2
  Top 0.508: v32.51,74.04 32.3,74.26 C26.1 U?2.9 | v56.52,73.15 JP3.1 | v56.52,73.15 57.53,73.15 | J9.2 62.67,70.56 60.07,73.15 v56.52,73.15 | v57.02,71.63 JP3.2
  Top 0.889: U$1.37 U$1.1
  Bottom 0.254: 64.64,47.24 64.52,47.37
  Bottom 0.406: v35.18,87.5 35.18,88.01 35.43,88.27 46.74,88.27 47.12,87.88 47.12,76.45
  Bottom 0.508: 59.82,52.07 64.52,47.37 | 59.18,4.7 U$1.1 64.64,9.65 64.64,47.24 55.63,56.26 55.63,72.52 56.26,73.15 v56.52,73.15 57.78,73.15 | 32.26,75.06 32.26,74.3 v32.51,74.04 34.92,71.63 45.59,71.63 47.12,73.15 v47.12,75.56 47.12,76.45 | J8.6 63.37,63.12 57.66,68.83 57.66,70.99 v57.02,71.63
  other vias: 32.26,74.68 47.12,76.33 57.4,73.15
  pour Top (no thermals): 41.53,78.36 44.45,78.36 44.96,77.85 49.4,77.85 49.66,77.6 49.66,73.28 48.77,72.39 41.66,72.39 41.27,72.77 41.27,78.11
+24V  (via drill 0.38 pad 0.51)  (12 unrouted)
  Top 0.254: 13.37,16.13 C4.2 | 54.99,69.98 JP3.3 | U2.2 42.85,84.96 | R34.2 46.95,86.74 47.62,86.74 D10.CATHODE 48.64,86.87 | D1.C 18.8,85.97 18.92,85.85 18.53,85.85 D1.C
  Top 0.508: U?1.4 15.41,14.31 14.1,15.62 13.25,16.51 C4.2 | U?1.11 15.98,9.76 14.48,8.25 12.45,8.25 12.06,7.87 12.06,7.23 C22.+ | U?3.4 15.79,53.8 13.97,55.63 13.5,55.63 C5.2 | U?3.11 15.72,49.25 14.99,48.51 14.99,46.99 14.61,46.61 C20.+
  Top 0.864: 37.45,59.2 37.46,59.2 37.46,57.91 | 37.46,57.91 v37.46,53.98 | C23.+ 37.46,57.91
  Top 0.889: v51.18,86.74 D10.CATHODE | 35.65,62.23 C21.1 35.94,65.44 35.94,68.71 36.83,69.6 C19.+ v40.64,69.6 53.98,69.6 54.36,69.6 JP3.3 | 35.65,62.23 35.65,60.2 | 35.65,60.2 35.65,59.84 | C4.2 R11.1 C17.1 7.66,16.29 6.35,14.99 6.35,7.87 7.11,7.11 12.18,7.11 C22.+ v14.21,7.11 | C25.1 15.79,5.42 14.22,6.98 | 23.62,69.22 U?2.4 29.97,69.22 32,67.18 32,63.25 32.64,62.61 35.27,62.61 35.65,62.23 | D4.C D3.C | 18.92,85.85 20.19,85.85 v20.83,85.22 | C5.2 R13.1 C18.1 7.41,55.79 | 7.41,55.79 6.35,54.74 6.35,47.37 7.49,46.23 11.82,46.23 C20.+ 12.43,46.35 15.88,46.35 16.38,45.85 C24.1 | 37.46,57.8 C23.+ | 7.41,55.79 7.41,58.33 9.02,59.94 35.39,59.94 | 35.39,59.94 35.65,60.2 | 37.45,59.2 36.83,59.94 35.39,59.94 | 47.62,86.74 47.62,86.61 46.86,85.85 45.34,85.85 | 45.34,85.85 42.88,85.85 | C10.1 45.34,85.85 | U2.3 U2.2
  Top 0.914: J9.1 60.96,67.06 58.29,69.72 54.1,69.72 53.98,69.6 | D2.C D1.C | D4.C 20.32,73.28 U?2.4
  Bottom 0.889: v40.64,69.6 47.12,69.6 50.16,72.64 50.16,86.74 v51.18,86.74 | v20.83,85.22 20.83,73.28 | 12.95,7.11 v14.21,7.11 21.97,7.11 32.13,17.27 32.13,48.64 v37.46,53.98 37.46,56.26
  Bottom 0.914: 20.83,73.28 v19.56,73.28
  other vias: 15.1,7.11 13.32,7.11 37.46,54.99 37.46,56.01 41.53,69.6 42.42,69.6 50.29,86.74 20.83,84.45 20.45,73.28
ENABLE_A  (via drill 0.2 pad 0.25)
  Top 0.254: v25.53,54.36 25.53,53.98 27.56,51.94 27.56,29.34 26.03,27.81 19.74,27.81 IC2.4
  Bottom 0.254: U?2.6 24.64,71.75 25.53,70.87 v25.53,54.36
ENABLE_B  (via drill 0.2 pad 0.25)
  Top 0.254: IC2.3 19.76,27.05 26.16,27.05 28.07,28.96 28.07,52.96 26.92,54.1 v26.8,54.36
  Bottom 0.254: U?2.11 29.08,78.11 26.8,75.69 v26.8,54.36
ENCODER_A1
  Top 0.254: R22.1 45.63,63.16 45.47,62.99 43.35,62.99 | 43.35,62.99 Q3.3 | 43.35,62.99 42.16,62.99 40.39,61.21 40.39,52.96 43.94,49.4 43.94,39.5 43.43,38.99 34.29,38.99 33.91,38.61 JP5.2 34.04,37.85
ENCODER_A1_IN
  Top 0.254: R33.2 47.37,66.8 48.89,68.33 56.77,68.33 J8.5
ENCODER_A2
  Top 0.254: R28.1 52.7,64.86 52.7,63.25 52.49,63.03 Q4.3 48.94,63.03 47.62,61.72 41.91,61.72 40.89,60.71 40.89,53.34 44.45,49.78 44.45,37.34 43.56,36.45 34.16,36.45 33.78,36.07 33.78,35.31 JP1.2
ENCODER_A2_IN
  Top 0.254: R32.2 55.24,66.8 63.75,58.29 64.26,58.29 J8.4
ENCODER_B1
  Top 0.254: Q5.3 43.73,55.67 | R1.1 45.59,57.49 45.59,55.88 45.38,55.67 43.73,55.67 | JP4.1 62.61,30.35 62.61,31.11 62.36,31.37 53.59,31.37 49.78,35.18 49.78,52.07 46.35,55.5 43.56,55.5 43.73,55.67
ENCODER_B1_IN
  Top 0.254: R30.2 47.37,59.44 48.77,60.83 59.18,60.83 62.23,57.78 62.61,57.4 J8.3
ENCODER_B2
  Top 0.254: R26.1 52.83,57.44 52.83,55.88 52.62,55.67 50.59,55.67 | Q6.3 50.59,55.67 | JP2.1 62.48,33.4 61.98,33.91 53.59,33.91 50.42,37.08 50.42,55.5 50.59,55.67
ENCODER_B2_IN
  Top 0.254: R31.2 58.04,59.44 J8.2
GND  (via drill 0.2 pad 0.25, 0.38 pad 0.51)  (2 unrouted)
  Top 0.254: R9.2 R8.2 | C20.- 15.21,41.8 C24.2 17.65,42.96 | 17.65,42.96 18.12,42.96 18.54,42.55 18.54,41.77 R14.1 | U?3.14 16.83,47.3 17.65,46.48 17.65,42.96 | D7.A D8.A | U?3.29 19.69,51.65 19.69,55.12 20.32,55.75 U?3.28 22.23,55.89 22.23,57.02 23.11,57.91 C23.- 32.64,57.77 v32.64,56.52 | C21.2 33.95,68.3 C19.- 34,70.94 C26.2 34.04,75.6 34.04,82.17 33.02,83.19 32.89,83.19 | U?2.15 32.89,83.19 | R23.1 42.46,65.33 Q3.2 42.36,64.2 v42.04,63.88 | R27.1 49.57,65.33 Q4.2 49.4,65.17 49.4,64.26 49.02,63.88 v48.64,63.88 | R25.1 49.57,57.97 Q6.2 49.4,57.8 49.4,56.77 49.15,56.52 48.77,56.52 | Q5.2 42.46,57.97 R24.1 42.46,57.06 v41.91,56.52 41.91,54.86 43.09,53.68 C1.2 | C25.2 16.64,2.41 16.38,2.16 12.33,2.16 C22.- | C13.2 23.58,32.64 22.23,32.64 C14.2 22.14,32.89 21.46,32.89 20.83,32.26 20.83,32 20.42,31.6 IC2.10 18.13,31.6 17.91,31.37 v17.91,26.16 | 48.77,56.52 v48.64,56.52 | U$1.38 48.77,7.24 48.51,7.24 43.43,12.32 | C16.2 25.23,5.08 v28.7,5.08 28.58,4.95 28.58,1.4 28.45,1.27 19.05,1.27 18.69,1.64 R15.1 | 48.77,56.52 48.77,54.74 v49.78,53.72 | 45.47,79.88 D9.ANODE 41.02,79.47 41.02,84.07 U2.9 38.86,84.96 U2.7 33.53,84.96 32.89,84.33 32.89,83.19 | 45.47,79.88 45.6,79.25 C11.2 C9.1 | C9.1 47.37,78.74 47.62,78.74 47.75,78.87 | C9.1 C8.1 49.29,78.36 58.29,78.36 58.8,78.87 58.8,79.25 59.18,79.63 59.18,81.15 | C10.2 45.34,80.01 45.47,79.88 | v51.18,53.72 61.21,53.72 J8.1 | 59.18,81.15 59.18,81.92 59.31,82.04 59.31,83.57 57.02,85.85 J10.GNDBREAK | J9.3 63.5,77.85 60.2,81.15 J10.GND 59.18,81.15 | C17.2 10.16,18.12 10.16,19.94 11.3,21.08 v17.91,21.08 18.03,21.08 18.92,20.19 18.92,13.59 v19.18,13.33
  Top 0.254: U?1.14 17.09,7.81 18.03,6.86 18.03,4.06 17.16,3.19 | U?1.28 20.19,16.26 20.07,16.13 20.07,14.22 v19.94,14.1
  Top 0.508: R7.2 R6.2 | v21.4,39.94 21.27,39.94 20.95,39.62 | v10.67,42.67 v10.67,41.66 | v10.67,41.66 v10.67,40.64 | v10.67,41.66 12.05,41.66 C20.-
  Top 0.889: C19.- 32,70.24 32,72.64 30.35,74.3 U?2.8 23.36,75.32 D5.A D6.A | U$1.94 U$1.GND U$1.58 43.69,12.32 48.77,7.24 | U$1.38 U$1.GND@2 U$1.2 | C15.2 21.84,40.39 v21.4,39.94 21.08,39.62 20.95,39.62 12.7,39.62 12.19,40.13 C20.- | v33.66,56.52 v32.64,56.52 v31.62,56.52 | D8.A 18.41,61.59 v18.16,61.34 | v10.29,58.67 C18.2 9.18,57.49 v9.14,57.53 | C14.2 v22.23,34.04
  Top 0.914: C22.- 10.68,2.3 v10.67,2.29 | v10.67,3.3 v10.67,1.27 | R15.1 17.56,2.79 17.16,3.19 C25.2
  Bottom 0.254: 46.35,63.88 v42.04,63.88 30.99,63.88 U?2.1 | 46.35,63.88 v48.64,63.88 | v41.91,56.52 v48.64,56.52 48.64,59.82 46.23,62.23 46.23,63.75 46.35,63.88 | v49.78,53.72 v51.18,53.72 | v17.91,26.16 v17.91,21.08
  Bottom 0.406: 2.41,50.93 1.91,50.93 1.91,58.67
  Bottom 0.508: v22.23,34.04 22.23,39.12 v21.4,39.94
  Bottom 0.889: U$1.94 35.94,12.32 v28.7,5.08 | U?2.1 30.35,66.29 v33.91,66.29 32.64,65.02 v32.64,56.52 | v18.41,53.59 18.16,53.85 v18.16,61.34 v14.86,61.34 10.67,61.34 10.29,60.96 v10.29,58.67 1.91,58.67 | v7.49,51.44 5.84,51.44 5.33,50.93 2.41,50.93
  Bottom 0.914: v7.49,11.94 5.84,11.94 5.33,11.43 2.67,11.43 1.91,12.19 1.91,20.07 3.3,21.46 17.53,21.46 v17.91,21.08
  other vias: 7.49,53.34 7.49,52.32 7.49,50.55 8.38,51.44 9.4,51.44 7.49,13.97 7.49,12.95 7.49,10.92 8.38,11.94 9.27,11.94 15.88,61.34 17.02,61.34 14.73,76.58 15.88,76.58 17.02,76.58 18.16,76.58 33.78,70.87 32.77,70.87 31.75,70.87 38.73,86.36 39.5,86.36 40.26,86.36 40.26,85.6 39.5,85.6 38.73,85.6 38.73,84.84 39.5,84.84 40.26,84.84 19.18,53.59 19.94,53.59 20.7,53.59 18.41,52.83 19.18,52.83 19.94,52.83 20.7,52.83 20.7,52.07 19.94,52.07 19.18,52.07 18.41,52.07 18.41,51.31 19.18,51.31 19.94,51.31 20.7,51.31 20.7,50.55 19.94,50.55 19.18,50.55 18.41,50.55 18.41,49.78 19.3,49.78 20.07,49.78 20.7,49.78 18.41,14.1 19.18,14.1 20.7,14.1 20.7,13.33 19.94,13.33 18.41,13.33 18.41,12.57 19.18,12.57 19.94,12.57 20.7,12.57 20.7,11.81 19.94,11.81 19.18,11.81 18.41,11.81 18.41,11.05 19.18,11.05 19.94,11.05 20.7,11.05 20.7,10.29 19.94,10.29 19.18,10.29 18.41,10.29 45.47,79.76 46.35,79.76 47.75,79.76 48.51,79.76 49.28,79.76
  pour Bottom (isolate 0.254, rank 2, no thermals): 0.64,89.53 66.42,89.53 66.93,89.03 66.93,0.64 66.42,0.13 0.64,0.13 0.13,0.64 0.13,89.03
  pour Top (isolate 0.254, rank 2, no thermals): 0.64,89.53 66.42,89.53 66.93,89.03 66.93,0.64 66.42,0.13 0.64,0.13 0.13,0.64 0.13,89.03
MOTOR_A1  (via drill 0.2 pad 0.25)
  Top 0.254: JP19.2 33.66,25.15 29.97,25.15 29.08,26.04 29.08,53.72 v28.45,54.36
  Bottom 0.254: v28.45,54.36 28.45,69.72 29.21,70.48 U?2.5
MOTOR_A2  (via drill 0.2 pad 0.25)
  Top 0.254: v27.56,54.36 28.58,53.34 28.58,24 31.37,21.21 62.48,21.21 62.86,21.59 62.86,22.35 JP17.1
  Bottom 0.254: U?2.7 29.34,73.03 27.56,71.25 v27.56,54.36
MOTOR_B1  (via drill 0.2 pad 0.25)
  Top 0.254: 33.53,27.3 JP20.2 30.48,27.56 29.59,28.45 29.59,50.16 29.72,50.29 v29.72,50.42
  Bottom 0.254: U?2.10 24.51,76.83 26.16,75.18 26.16,53.98 v29.72,50.42
MOTOR_B2  (via drill 0.2 pad 0.25)
  Top 0.254: JP18.1 62.86,19.81 62.86,18.92 62.61,18.67 35.56,18.67 35.18,18.29 31.24,18.29 v23.62,25.91
  Bottom 0.254: U?2.12 24.26,79.38 22.86,77.98 22.86,26.67 v23.62,25.91
N$1  (via drill 0.2 pad 0.25)
  Top 0.254: v30.23,34.42 30.23,33.44 R3.2 | v23.49,35.69 21.59,35.69 20.83,34.92 20.83,33.78 20.59,33.55 20.34,33.55 IC2.13
  Bottom 0.254: v23.49,35.69 28.96,35.69 v30.23,34.42
N$2  (via drill 0.2 pad 0.25)
  Top 0.254: v30.23,32.13 30.23,31.15 R2.2 | v23.49,34.8 21.72,34.8 21.34,34.42 21.34,33.53 20.7,32.9 IC2.12
  Bottom 0.254: v23.49,34.8 28.7,34.8 30.23,33.4 v30.23,32.13
N$3
  Top 0.254: U?3.2 16.02,55.1 15.24,55.88 15.24,57.7 C3.2
N$4
  Top 0.254: U?3.1 16.76,57.37 C3.1
N$5
  Top 0.254: U?1.2 16.14,15.61 15.37,16.38 15.37,18.07 C2.2
N$6
  Top 0.254: U?1.1 16.76,18.38 C2.1
N$7
  Top 0.508: U?3.9 15.12,50.55 14.1,49.53 12.07,49.53 R6.1
N$8
  Top 0.508: U?3.6 14.81,52.5 14.22,53.09 12.2,53.09 11.94,53.34 R7.1
N$9
  Top 0.254: U?3.17 U?3.16 23.29,47.95 23.62,47.62 23.62,45.81 R10.2
N$10
  Top 0.889: U?2.2 18.66,66.67 D8.C D4.A 18.41,69.85 17.22,71.04 J5.1
N$11  (via drill 0.38 pad 0.51)  (2 unrouted)
  Top 0.508: U?3.5 15.43,53.15 13.97,54.61 13.59,54.61
  Top 0.889: v11.68,54.61 13.59,54.61
  Bottom 0.889: v11.68,54.61 10.03,56.13 J2.1
  other vias: 12.57,54.61 13.46,54.61
N$12  (via drill 0.38 pad 0.51)  (1 unrouted)
  Top 0.508: U?3.7 14.13,51.85 v14.1,51.82
  Top 0.889: v14.1,51.82 13.08,51.82
  Bottom 0.889: v14.1,51.82 12.19,51.82 9.65,54.36 4.83,54.36 4.06,53.59 4.06,52.76 J2.2
  other vias: 13.21,51.82
N$13  (via drill 0.38 pad 0.51)  (1 unrouted)
  Top 0.508: U?3.10 15.36,49.9 v14.1,48.64
  Top 0.889: v14.1,48.64 13.08,48.64
  Bottom 0.889: v14.1,48.64 11.05,48.64 9.91,47.5 5.8,47.5 J2.4
  other vias: 13.21,48.64
N$14  (via drill 0.38 pad 0.51)  (1 unrouted)
  Top 0.508: U?3.8 14.63,51.2 v14.1,50.67
  Top 0.889: v14.1,50.67 13.08,50.67
  Bottom 0.889: v14.1,50.67 10.79,50.67 9.27,49.15 3.95,49.15 J2.3
  other vias: 13.21,50.67
N$15
  Top 0.508: U?1.9 15.37,11.06 14.86,10.54 14.73,10.41 11.69,10.41 R8.1 11.56,9.91 11.68,9.78
N$16
  Top 0.508: U?1.6 14.68,13.01 14.22,13.46 R9.1
N$17  (via drill 0.38 pad 0.51)  (1 unrouted)
  Top 0.508: U?1.5 15.05,13.66 13.34,15.11 12.83,15.11
  Top 0.889: v11.56,15.11 12.83,15.11
  Bottom 0.889: J4.1 4.32,16.38 9.65,16.38 11.05,15.11 v11.56,15.11 12.83,15.11
  other vias: 12.57,15.11
N$18  (via drill 0.38 pad 0.51)
  Top 0.508: U?1.7 14.01,12.36 v13.97,12.32
  Top 0.889: v13.97,12.32 v13.08,12.32
  Bottom 0.889: v13.97,12.32 11.94,12.32 9.14,15.11 5.21,15.11 4.06,13.97 4.06,13.39 J4.2
N$19  (via drill 0.38 pad 0.51)
  Top 0.508: U?1.10 15.74,10.41 14.86,9.53 v14.1,9.53
  Top 0.889: v14.1,9.53 v13.08,9.53
  Bottom 0.889: v14.1,9.53 11.18,9.53 9.91,8.25 5.08,8.25 3.94,7.11 J4.4
N$20  (via drill 0.38 pad 0.51)
  Top 0.508: U?1.8 15.01,11.71 14.61,11.3 v13.97,11.3
  Top 0.889: v13.97,11.3 v13.08,11.3
  Bottom 0.889: v13.97,11.3 12.95,11.3 12.45,10.79 10.29,10.79 9.14,9.65 4.05,9.65 J4.3
N$21
  Top 0.254: R11.2 C4.1 13.55,17.78 13.97,17.78 14.73,17.02 14.73,16 15.78,14.96 U?1.3
N$22
  Top 0.254: U?3.3 15.9,54.45 14.73,55.63 14.73,56.64 14.1,57.28 13.55,57.28 C5.1
  Top 0.889: C5.1 R13.2
N$23  (1 unrouted)
  Top 0.254: 28.58,67.69 29.21,67.69 U?2.3
  Top 0.889: U?2.3 27.69,67.94 24.51,64.77 15.75,64.77 14.61,65.91 D3.A 14.36,69.22 5.71,69.22 3.94,67.44 J5.2
N$24
  Top 0.254: 14.44,81.84 D2.A 14.61,81.79
  Top 0.889: U?2.13 26.67,83.44 16.37,83.44 D2.A D6.C 14.36,79.38 7.37,79.38 4.78,81.97 J6.1
N$25
  Top 0.889: U?2.14 24.14,81.67 D1.A D5.C 16.91,78.11 J6.2
N$26  (2 unrouted)
  Top 0.889: JP26.1 U$1.62
N$27
  Top 0.254: R17.2 9.91,35.43 11.18,34.16 12.34,34.16 IC2.15
N$28
  Top 0.254: U?1.17 U?1.16 24.88,8.46 R12.2
N$29
  Top 0.254: IC2.16 9.85,33.55 R18.2
N$30
  Top 0.254: IC2.17 10.51,32.9 R19.2
N$31
  Top 0.254: R15.3 19.69,7.87 19.18,8.38 16.84,8.38 U?1.13 U?1.12
N$32
  Top 0.254: IC2.18 11.42,32.25 10.41,31.24 10.38,31.24 R20.1
N$33
  Top 0.254: IC2.28 5.3,25.75 J7.6
N$34
  Top 0.254: R14.3 19.05,47.24 18.41,48.01 16.82,48.01 U?3.13 U?3.12
N$35
  Top 0.254: IC2.27 4.46,26.4 J7.5
N$36
  Top 0.254: IC2.26 6.35,27.05 J7.4
N$37
  Top 0.254: IC2.25 7.48,27.7 6.1,29.21 6.1,29.72 3.94,31.88 J7.3
N$38
  Top 0.254: IC2.24 7.72,28.35 6.6,29.46 6.6,30.23 5.84,30.99 5.84,32.64 J7.2
N$39  (2 unrouted)
  Top 0.889: JP25.1 U$1.61
N$40  (1 unrouted)
  Top 0.889: JP1.1 U$1.103 U$1.67
N$41
  Top 0.889: U$1.48 U$1.A0 U$1.12 JP2.2
N$42
  Top 0.889: U$1.47 U$1.A1 U$1.11 JP4.2
N$43
  Bottom 0.889: 11.81,54.61 13.34,54.61
N$44
  Top 0.254: 36.32,37.72 U$1.104
  Top 0.889: U$1.68 U$1.C4 36.32,37.72 JP5.1
N$45
  Top 0.889: 15.37,7.11 13.34,7.11 12.95,7.11
N$46
  Top 0.889: U$1.108 U$1.C0 U$1.72
N$47
  Top 0.889: U$1.107 U$1.C1 U$1.71
N$48
  Top 0.889: U$1.106 U$1.C2 U$1.70
N$49
  Top 0.889: U$1.105 U$1.C3 U$1.69
N$50
  Top 0.889: U$1.96 U$1.D6 U$1.60
N$51
  Top 0.254: R27.2 51.56,66.8 | 51.56,66.8 51.56,65.43 Q4.1 | 51.56,66.8 R32.1
N$52
  Top 0.254: R30.1 R24.2 44.16,57.97 Q5.1
N$53
  Top 0.254: R31.1 R25.2 51.27,57.97 Q6.1
N$54
  Top 0.254: U2.8 36.62,82.18 C7.2 36.49,80 D9.CATHODE 37.24,76.32 L4.1
  pour Top (no thermals): 35.94,84.2 37.08,84.2 37.34,83.95 37.34,81.53 37.72,81.15 38.61,81.15 38.99,80.77 38.99,79.38 39.75,78.61 40.26,78.61 40.64,78.23 40.64,72.64 40.39,72.39 37.59,72.39 36.96,73.03 36.96,77.85 35.69,79.12 35.69,83.95
N$55
  Top 0.254: Q3.1 44.26,66.7 R23.2 R33.1
N$56  (via drill 0.2 pad 0.25)
  Top 0.254: C7.1 v39.24,82.04 | v42.55,83.06 42.55,83.64 U2.1
  Bottom 0.254: v39.24,82.04 41.91,82.04 42.55,82.68 v42.55,83.06
N$57
  Top 0.254: U2.4 44.49,87.5 R34.1
N$58
  Top 0.914: J10.PWR 49.53,81.15 48.51,82.17 D10.ANODE
N$59
  Top 0.889: U$1.95 U$1.D7 U$1.59
N$61
  Top 0.889: U$1.46 U$1.A2 U$1.10 JP13.2
N$62
  Top 0.889: U$1.45 U$1.A3 U$1.9 JP14.2
N$63
  Top 0.889: U$1.44 U$1.A4 U$1.8 JP17.2
N$64
  Top 0.889: U$1.43 U$1.A5 U$1.7 JP18.2
N$65  (2 unrouted)
  Top 0.889: JP19.1 U$1.63
N$66  (2 unrouted)
  Top 0.889: JP20.1 U$1.64
N$67  (2 unrouted)
  Top 0.889: JP21.1 U$1.65
N$68  (2 unrouted)
  Top 0.889: JP22.1 U$1.66
N$69
  Top 0.889: U$1.93 U$1.VBAT U$1.57
N$70
  Top 0.889: U$1.92 U$1.RST U$1.56
N$71
  Top 0.889: U$1.39 U$1.TX U$1.3
N$72
  Top 0.889: U$1.40 U$1.RX U$1.4
N$73
  Top 0.254: R14.2 20.83,42.05 20.83,44.32 21.8,45.3 C15.1 21.84,47.24 21.9,47.3 U?3.15
N$74
  Top 0.889: U$1.41 U$1.WKP | U$1.WKP 57.78,14.86 | 59.56,14.99 U$1.5 U$1.WKP
N$75
  Top 0.889: U$1.42 U$1.DAC U$1.6
N$76
  Top 0.889: U$1.49 U$1.B5 U$1.13
N$77
  Top 0.889: U$1.50 U$1.B4 U$1.14
N$78
  Top 0.254: U?1.15 22.36,4.69 23.49,3.56 24.73,3.56 C16.1 23.96,2.79 R15.2
N$79
  Top 0.889: U$1.15 U$1.B3 U$1.51
N$80
  Top 0.889: U$1.52 U$1.B2 U$1.16
N$81
  Top 0.889: U$1.17 U$1.B1 U$1.53
N$82
  Top 0.889: U$1.54 U$1.B0 U$1.18
SCL
  Top 0.254: JP21.2 32.85,30.1 R4.1 R2.1
SDA
  Top 0.254: JP22.2 32.51,32.64 32.38,32.77 32.38,33.49 R3.1 R5.1
STEP1_DIR  (via drill 0.2 pad 0.25)
  Top 0.254: 33.91,19.81 JP25.2 v33.78,18.92 | U?1.20 24,11.06 24,11.05 v29.84,11.05
  Bottom 0.254: v33.78,18.92 33.78,13.72 31.12,11.05 v29.84,11.05
STEP1_EN  (via drill 0.2 pad 0.25)
  Top 0.254: 19.53,25.65 IC2.1 19.43,25.55 19.43,23.5 25.78,17.14 25.78,14.1 25.27,13.59 v25.27,12.95 | U?1.21 25.17,11.71 v25.27,11.81
  Bottom 0.254: v25.27,11.81 v25.27,12.95
STEP1_MODE0
  Top 0.254: U?1.24 24.45,13.66 25.27,14.48 25.27,16.76 16.89,25.15 16.89,28.57 15.24,30.23 12.45,30.23 IC2.21
STEP1_MODE1
  Top 0.254: IC2.22 15.06,29.65 16.38,28.32 16.38,24.89 24.77,16.51 24.77,14.73 24.38,14.35 22.41,14.35 U?1.25
STEP1_MODE2
  Top 0.254: IC2.23 12.45,28.96 14.99,28.96 15.75,28.19 15.75,24.77 24.26,16.26 24.26,15.37 23.88,14.99 22.39,14.99 U?1.26
STEP1_STEP  (via drill 0.2 pad 0.25)
  Top 0.254: v33.15,22.35 33.66,22.35 JP26.2 | U?1.22 29.81,12.36 v29.84,12.32
  Bottom 0.254: v33.15,22.35 33.15,14.22 31.62,12.7 31.24,12.32 v29.84,12.32
STEP2_DIR  (via drill 0.2 pad 0.25)
  Top 0.254: U?3.20 23.36,50.55 24.13,49.78 v24.13,34.04 | v30.23,23.75 62.36,23.75 62.61,24 62.61,24.89 JP14.1
  Bottom 0.254: v24.13,34.04 24.13,29.84 v30.23,23.75
STEP2_EN
  Top 0.254: U?3.21 23.6,51.2 24.77,50.04 24.77,30.48 24.64,30.23 19.83,30.23 IC2.8
STEP2_MODE0
  Top 0.254: U?3.24 23.94,53.15 26.03,51.05 26.03,30.48 25.15,29.59 19.68,29.59 IC2.7
STEP2_MODE1
  Top 0.254: U?3.25 24.05,53.8 26.54,51.31 26.54,30.1 25.53,29.08 19.71,29.08 IC2.6
STEP2_MODE2
  Top 0.254: U?3.26 24.29,54.45 27.05,51.69 27.05,29.72 25.78,28.45 19.73,28.45 IC2.5
STEP2_STEP  (via drill 0.2 pad 0.25)
  Top 0.254: U?3.22 23.84,51.85 25.4,50.29 v25.4,34.04 | v30.35,26.29 62.48,26.29 62.61,26.42 62.61,27.43 JP13.1
  Bottom 0.254: v25.4,34.04 25.4,31.24 v30.35,26.29
VDD  (via drill 0.2 pad 0.25, 0.25 pad 0.38)
  Top 0.254: R17.1 R18.1 R19.1 R20.2 | IC2.9 21.84,30.95 | 21.84,30.95 22.18,30.95 C14.1 C13.1 | R22.2 47.33,63.03 v47.37,62.99 | v54.36,63.12 54.36,64.81 R28.2 | R1.2 47.33,56.55 v48.13,55.75 | v54.36,55.88 54.36,57.44 R26.2 | 30.73,35.52 R5.2 30.99,35.77 v30.99,37.08 | v21.21,30.86 21.76,30.86 21.84,30.95 | C1.1 45.05,53.34 v45.97,53.34 | v30.99,28.57 30.99,29.25 R4.2 | 23.49,43.47 R10.1
  Top 0.406: U$1.91 31.37,4.7 30.73,5.33 30.73,6.98 | 30.73,6.98 30.73,14.99 v21.21,24.51 | R12.1 30.52,6.77 30.73,6.98 | R10.1 23.49,43.22 v23.49,37.08 v21.21,37.08 J7.1 | R20.2 8.17,29.81 v8.64,29.34
  Top 0.889: U$1.91 U$1.3V3 U$1.55
  Bottom 0.254: v47.37,62.99 54.23,62.99 | 54.23,62.99 v54.36,63.12 | 54.23,62.99 54.23,56.01 v54.36,55.88 54.23,55.75 v48.13,55.75 48.13,53.98 47.5,53.34 v45.97,53.34
  Bottom 0.406: v21.21,30.86 v21.21,37.08 | v23.49,37.08 v30.99,37.08 v30.99,28.57 | v8.64,29.34 19.69,29.34 v21.21,30.86 | v21.21,24.51 v21.21,30.86 | U$1.55 44.07,4.7 45.97,6.6 v45.97,53.34
(copper drawn outside any net)
  shapes: Top area x4

### Text on the board
tPlace: A1 | A2 | B1 | B2
bPlace: M+ | M- | M+ | M- | A- | A+ | B+ | B- | A3 | A4 | A5 | A6 | A7 | A- | A+ | B+ | B-